# EAGLE design uradmonitor_D (EAGLE 6.1)
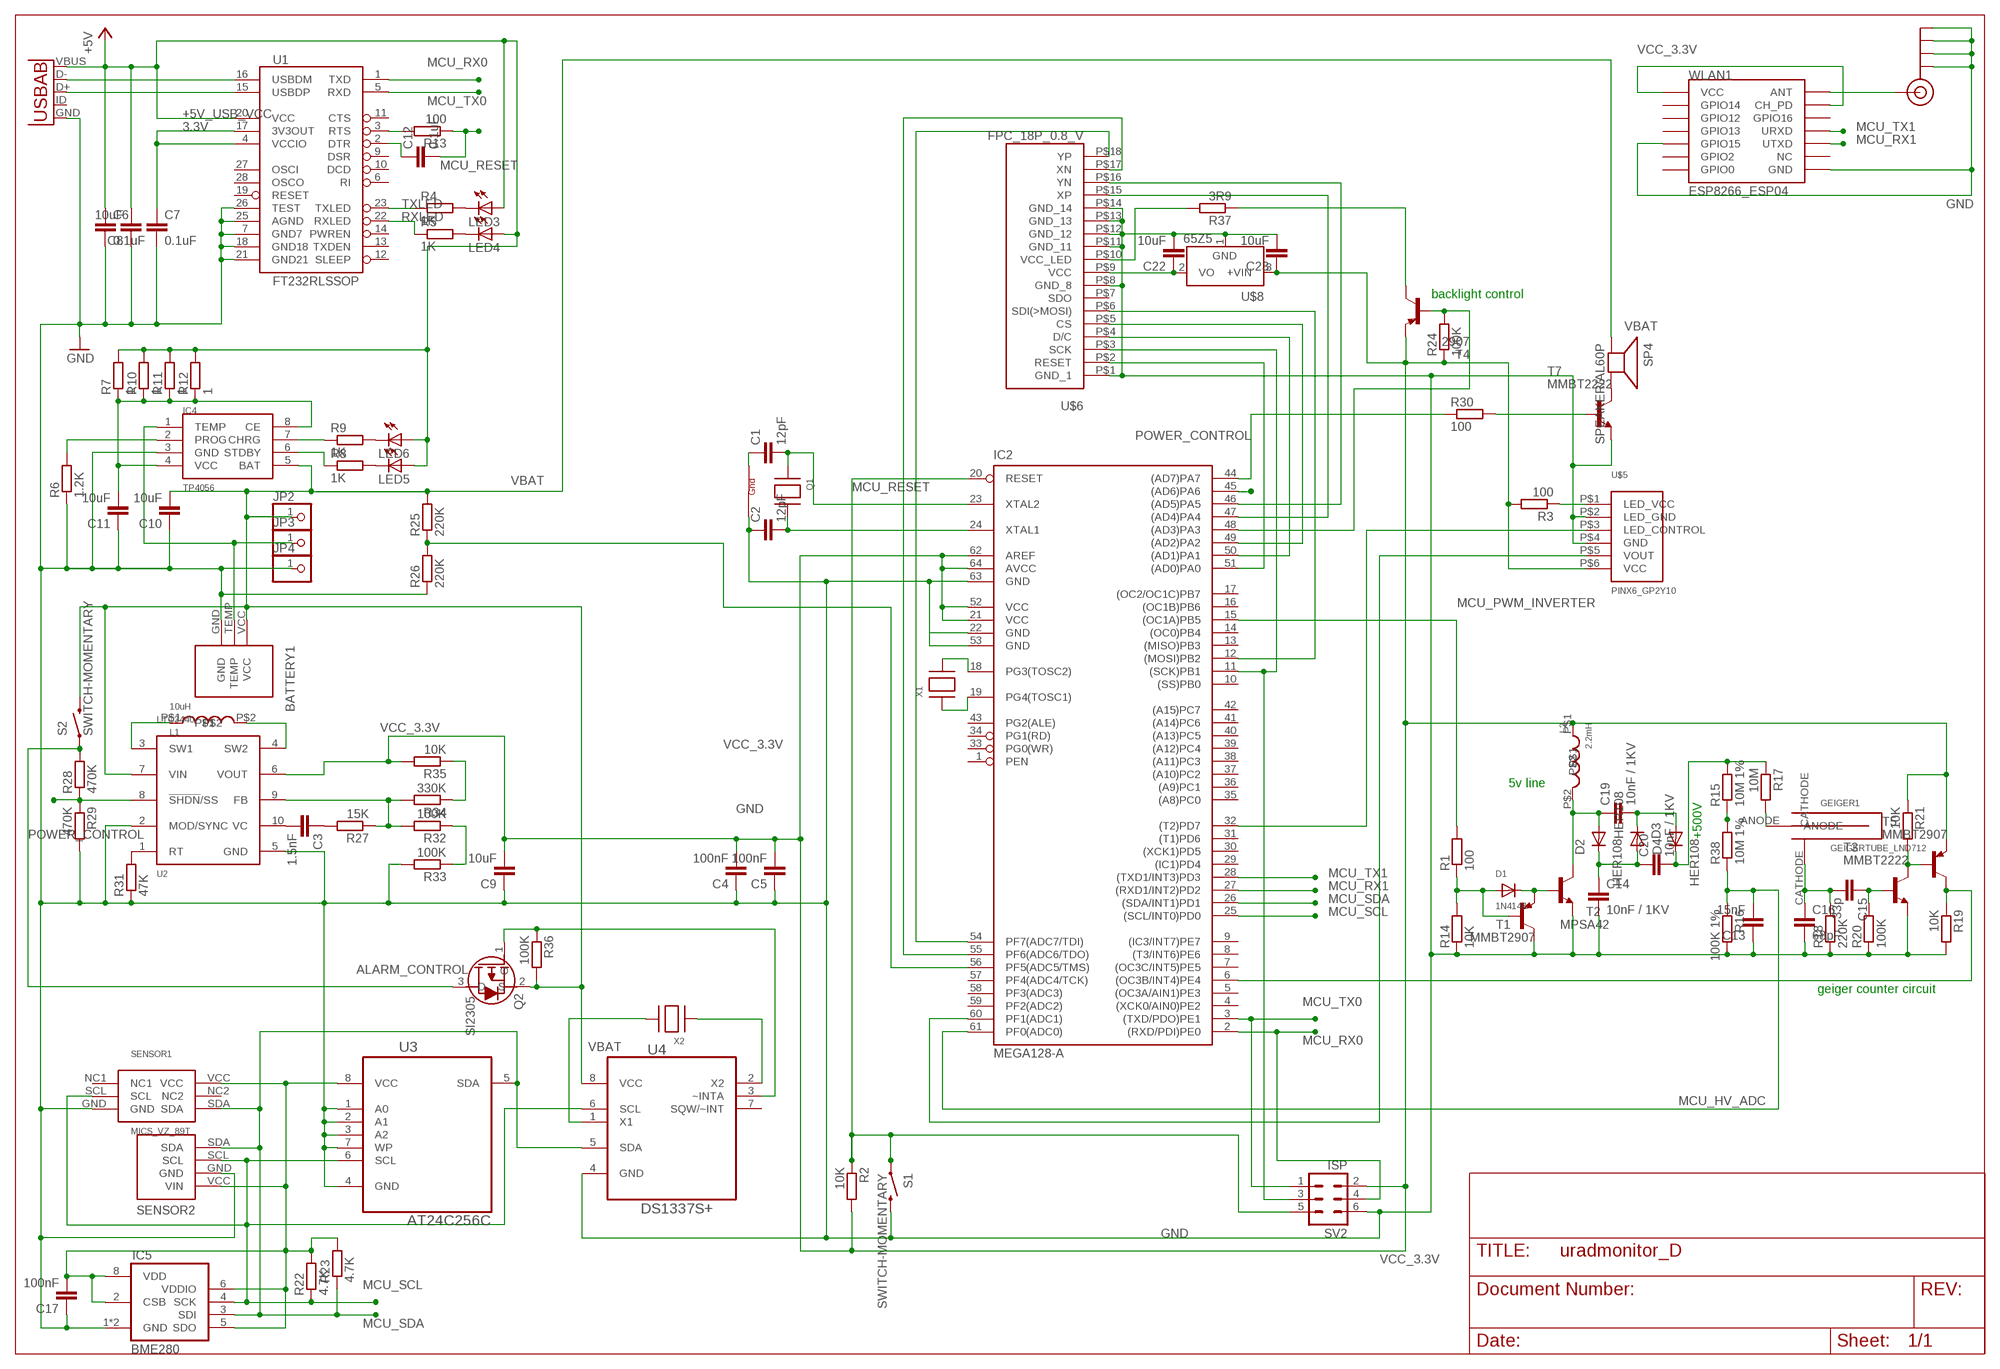
[diagram p0: schematic, sheet 1]

## Parts
BATTERY1  BAT-CASIO-NP40BATTERY  [BAT-CASIO-NP40]
C1  12pF  C-EUC0805K  [C0805K]
C2  12pF  C-EUC0805K  [C0805K]
C3  1.5nF  C-EUC0805K  [C0805K]
C4  100nF  C-EUC0805K  [C0805K]
C5  100nF  C-EUC0805K  [C0805K]
C6  0.1uF  CAP0805  [0805]
C7  0.1uF  CAP0805  [0805]
C8  10uF  C-EUC0805K  [C0805K]
C9  10uF  C-EUC0805K  [C0805K]
C10  10uF  C-EUC0805K  [C0805K]
C11  10uF  C-EUC0805K  [C0805K]
C12  0.1uF  CAP0805  [0805]
C13  15nF  C-EUC0805K  [C0805K]
C14  10nF / 1KV  C-EUC1206K  [C1206K]
C15  33p  C-EUC0805K  [C0805K]
C16  68pF  C-EUC0805K  [C0805K]
C17  100nF  C-EUC0805K  [C0805K]
C19  10nF / 1KV  C-EUC1206K  [C1206K]
C20  10nF / 1KV  C-EUC1206K  [C1206K]
C22  10uF  C-EUC0805  [C0805]
C23  10uF  C-EUC0805  [C0805]
D1  1N4148  DIODESOD-323F  [SOD-323F]
D2  HER108  DIODE-DO-214AC  [DO-214AC]
D3  HER108  DIODE-DO-214AC  [DO-214AC]
D4  HER108  DIODE-DO-214AC  [DO-214AC]
GEIGER1  GEIGERTUBE_LND712  [GEIGERTUBE_LND712]
IC2  MEGA128-A  [TQFP64]
IC4  TP4056  [TP4056]
IC5  BME280  [BME280]
J$1  SMA_EDGE  [SMA-EDGE]
JP2  PINHD-1X1CB  [1X01-CLEANBIG]
JP3  PINHD-1X1CB  [1X01-CLEANBIG]
JP4  PINHD-1X1CB  [1X01-CLEANBIG]
L1  10uH  INDUCTOR  [DO1608]
L2  2.2mH  INDUCTOR  [DO1608]
LED3  LEDCHIP-LED0805  [CHIP-LED0805]
LED4  LEDCHIP-LED0805  [CHIP-LED0805]
LED5  LED3MM  [LED3MM]
LED6  LED3MM  [LED3MM]
Q1  XTAL-4-3225  [NX3225]
Q2  SI2305  [SOT23]
R1  100  R-EU_R0805  [R0805]
R2  10K  R-EU_R0805  [R0805]
R3  100  R-EU_R0805  [R0805]
R4  1K  R-EU_R0805  [R0805]
R5  1K  R-EU_R0805  [R0805]
R6  1.2K  R-EU_R0805  [R0805]
R7  1  R-EU_R0805  [R0805]
R8  1K  R-EU_R0805  [R0805]
R9  1K  R-EU_R0805  [R0805]
R10  1  R-EU_R0805  [R0805]
R11  1  R-EU_R0805  [R0805]
R12  1  R-EU_R0805  [R0805]
R13  100  R-EU_R0805  [R0805]
R14  10K  R-EU_R0805  [R0805]
R15  10M 1%  R-EU_0204/7  [0204/7]
R16  100K 1%  R-EU_R0805  [R0805]
R17  10M  R-EU_0204/7  [0204/7]
R18  220K  R-EU_0204/7  [0204/7]
R19  10K  R-EU_R0805  [R0805]
R20  100K  R-EU_R0805  [R0805]
R21  10K  R-EU_R0805  [R0805]
R22  4.7K  R-EU_R0805  [R0805]
R23  4.7K  R-EU_R0805  [R0805]
R24  100K  R-EU_R0805  [R0805]
R25  220K  R-EU_R0805  [R0805]
R26  220K  R-EU_R0805  [R0805]
R27  15K  R-EU_R0805  [R0805]
R28  470K  R-EU_R0805  [R0805]
R29  470K  R-EU_R0805  [R0805]
R30  100  R-EU_R0805  [R0805]
R31  47K  R-EU_R0805  [R0805]
R32  100K  R-EU_R0805  [R0805]
R33  100K  R-EU_R0805  [R0805]
R34  330K  R-EU_R0805  [R0805]
R35  10K  R-EU_R0805  [R0805]
R36  100K  R-EU_R0805  [R0805]
R37  3R9  R-EU_R0805  [R0805]
R38  10M 1%  R-EU_0204/7  [0204/7]
S1  SWITCH-MOMENTARY  SWITCH-MOMENTARY-2-SMD-1101NE  [TACTILE-SWITCH-1101NE]
S2  SWITCH-MOMENTARY  SWITCH-MOMENTARY-2SIDE_EZ  [TACTILE-PTH-SIDEEZ]
SENSOR1  MICS_VZ_89T  [MICS_VZ_89T]
SENSOR2  BMP180  SENSOR_GY68GY-86DIP  [SENSOR_GY68]
SP4  SPEAKER/AL60P  [AL60P]
SV2  ISP  MA03-2  [MA03-2]
T1  MMBT2907  MMBT2907ALT1-PNP-SOT23-BEC  [SOT23-BEC]
T2  MPSA42  MMBTA42LT1-NPN-SOT23-BEC  [SOT23-BEC]
T3  MMBT2222  MMBT2222ALT1-NPN-SOT23-BEC  [SOT23-BEC]
T4  2907  MMBT2907ALT1-PNP-SOT23-BEC  [SOT23-BEC]
T5  MMBT2907  MMBT2907ALT1-PNP-SOT23-BEC  [SOT23-BEC]
T7  MMBT2222  MMBT2222ALT1-NPN-SOT23-BEC  [SOT23-BEC]
U1  FT232RLSSOP  [SSOP28DB]
U2  LTC3440  [MSOP-10]
U3  AT24C256C  AT24C512BN-SH25-B  [SOIC127P600X175-8N]
U4  DS1337S+  [SOIC127P600X175-8N]
U$2  USB_AB  [USB-AB-MICRO-SMD]
U$5  PINX6_GP2Y10  [PINX6_GP2Y10]
U$6  FPC_18P_0.8_V  [FPC_18P_0.8_V]
U$8  65Z5  [SOT23]
WLAN1  ESP8266_ESP04  [ESP8266_ESP04]
X1  XTAL-3.2X1.5  [XTAL3215]
X2  XTAL-3.2X1.5  [XTAL3215]

## Nets
3.3V [power]: C7.1 U1.4(VCCIO) U1.17(3V3OUT)
+5V_USB_VCC: C6.1 C8.2 LED3.A LED4.A LED5.A LED6.A R7.2 R10.2 R11.2 R12.2 U1.20(VCC) U$2.VBUS ; supply symbol labelled +5V
ALARM_CONTROL: Q2.3(D) R28.2 S2.1
GND: BATTERY1.GND C2.1 C4.1 C5.1 C6.2 C7.2 C8.1 C9.1 C10.1 C11.1 C13.1 C14.2 C16.2 C17.1 C22.2 C23.2 IC2.22(GND) IC2.53(GND) IC2.63(GND) IC4.3(GND) IC5.1(GND) IC5.7(GND) J$1.GND@0(GND) J$1.GND@1(GND) J$1.GND@2(GND) J$1.GND@3(GND) JP4.1 Q1.2(G2) R6.1 R14.1 R16.2 R18.1 R19.2 R20.1 R26.1 R29.2 R31.1 R33.2 S1.P$2 SENSOR1.GND SENSOR2.GND SV2.6 T1.C T2.E T3.E T7.E U1.7(GND7) U1.18(GND18) U1.21(GND21) U1.25(AGND) U1.26(TEST) U2.2(MOD/SYNC) U2.5(GND) U3.1(A0) U3.2(A1) U3.3(A2) U3.4(GND) U3.7(WP) U4.4(GND) U$2.GND U$5.P$2(LED_GND) U$5.P$4(GND) U$6.P$1(GND_1) U$6.P$8(GND_8) U$6.P$11(GND_11) U$6.P$12(GND_12) U$6.P$13(GND_13) U$6.P$14(GND_14) U$8.1(GND) WLAN1.GND WLAN1.GPIO15
MCU_HV_ADC: C13.2 IC2.61(PF0(ADC0)) R16.1 R38.1
MCU_INT4: IC2.6((OC3B/INT4)PE4) R19.1 T5.C
MCU_PWM_INVERTER: IC2.15((OC1A)PB5) R1.2
MCU_RESET: C12.2 IC2.20(RESET) R2.1 R13.1 S1.P$1 SV2.5
MCU_RX0: IC2.2((RXD/PDI)PE0) SV2.4 U1.1(TXD)
MCU_RX1: IC2.27((RXD1/INT2)PD2) WLAN1.UTXD
MCU_SCL: IC2.25((SCL/INT0)PD0) IC5.4(SCK) R22.1 SENSOR1.SCL SENSOR2.SCL U3.6(SCL) U4.6(SCL)
MCU_SDA: IC2.26((SDA/INT1)PD1) IC5.3(SDI) R23.1 SENSOR1.SDA SENSOR2.SDA U3.5(SDA) U4.5(SDA)
MCU_TX0: IC2.3((TXD/PDO)PE1) SV2.1 U1.5(RXD)
MCU_TX1: IC2.28((TXD1/INT3)PD3) WLAN1.URXD
N$1: J$1.SIG(SIGNAL) WLAN1.ANT
N$2: LED3.C R4.2
N$3: IC2.56(PF5(ADC5/TMS)) R25.1 R26.2
N$4: L1.P$2 U2.4(SW2)
N$5: R3.1 U$5.P$1(LED_VCC)
N$6: IC2.11((SCK)PB1) SV2.3 U$6.P$3(SCK)
N$7: LED4.C R5.2
N$8: D1.A R1.1 R14.2 T1.B
N$9: C1.2 IC2.23(XTAL2) Q1.1(X1)
N$10: L1.P$1 U2.3(SW1)
N$11: C2.2 IC2.24(XTAL1) Q1.3(X2)
N$12: IC2.18(PG3(TOSC2)) X1.P$2
N$13: R37.1 T4.C
N$14: IC2.12((MOSI)PB2) U$6.P$6(SDI(>MOSI))
N$15: U1.16(USBDM) U$2.D-
N$16: U1.15(USBDP) U$2.D+
N$17: D1.C T1.E T2.B
N$18: IC4.6(STDBY) R8.1
N$19: GEIGER1.ANODE R17.2
N$20: C15.1 R20.2 T3.B
N$21: IC4.7(CHRG) R9.1
N$22: LED6.K(C) R9.2
N$23: IC2.32((T2)PD7) U$5.P$3(LED_CONTROL)
N$24: LED5.K(C) R8.2
N$26: C12.1 U1.2(DTR)
N$27: IC4.2(PROG) R6.2
N$28: R13.2 U1.3(RTS)
N$29: C11.2 IC4.4(VCC) IC4.8(CE) R7.1 R10.1 R11.1 R12.1
N$30: IC2.19(PG4(TOSC1)) X1.P$1
N$31: BATTERY1.TEMP IC4.1(TEMP) JP3.1
N$32: IC2.60(PF1(ADC1)) U$5.P$5(VOUT)
N$33: IC2.44((AD7)PA7) R30.1
N$34: R31.2 U2.1(RT)
N$35: C14.1 C20.1 D2.C D3.A
N$36: IC2.51((AD0)PA0) U$6.P$2(RESET)
N$37: C3.2 U2.10(VC)
N$38: IC2.50((AD1)PA1) U$6.P$4(D/C)
N$39: IC2.49((AD2)PA2) U$6.P$5(CS)
N$40: IC2.47((AD4)PA4) U$6.P$15(XP)
N$41: IC2.46((AD5)PA5) U$6.P$16(YN)
N$42: C15.2 C16.1 GEIGER1.CATHODE R18.2
N$43: IC2.54(PF7(ADC7/TDI)) U$6.P$18(YP)
N$44: IC2.55(PF6(ADC6/TDO)) U$6.P$17(XN)
N$45: IC2.48((AD3)PA3) R24.2 T4.B
N$46: C3.1 R27.2
N$47: R27.1 R32.2 R34.2 U2.9(FB)
N$49: R32.1 R33.1
N$50: R34.1 R35.1
N$51: C19.1 D2.A L2.P$2 T2.C
N$52: C22.1 U$6.P$9(VCC) U$8.2(VO)
N$53: C19.2 D3.C D4.A
N$54: C20.2 D4.C R15.2 R17.1
N$55: U4.2(X2) X2.P$1
N$56: U4.1(X1) X2.P$2
N$57: R30.2 T7.B
N$59: R21.2 T3.C T5.B
N$61: R15.1 R38.2
N$65: Q2.1(G) R36.1 U4.3(~INTA)
N$69: C1.1 Q1.4(G1)
N$75: R37.2 U$6.P$10(VCC_LED)
POWER_CONTROL: IC2.45((AD6)PA6) R28.1 R29.1 U2.8(!SHDN!/SS)
RXLED: R5.1 U1.22(RXLED)
SOLDER_TUBE: SP4.2(-) T7.C
TXLED: R4.1 U1.23(TXLED)
VBAT: BATTERY1.VCC C10.2 IC4.5(BAT) JP2.1 Q2.2(S) R25.2 R36.2 S2.2 SP4.1(+) U2.7(VIN) U4.8(VCC)
VCC_3.3V: C4.2 C5.2 C9.2 C17.2 C23.1 IC2.21(VCC) IC2.52(VCC) IC2.62(AREF) IC2.64(AVCC) IC5.2(CSB) IC5.5(SDO) IC5.6(VDDIO) IC5.8(VDD) L2.P$1 R2.2 R3.2 R21.1 R22.2 R23.2 R24.1 R35.2 SENSOR1.VCC SENSOR2.VCC(VIN) SV2.2 T4.E T5.E U2.6(VOUT) U3.8(VCC) U$5.P$6(VCC) U$8.3(+VIN) WLAN1.CH_PD WLAN1.VCC
Unconnected: IC2.1(PEN) IC2.4((XCK0/AIN0)PE2) IC2.5((OC3A/AIN1)PE3) IC2.7((OC3C/INT5)PE5) IC2.8((T3/INT6)PE6) IC2.9((IC3/INT7)PE7) IC2.10((SS)PB0) IC2.13((MISO)PB3) IC2.14((OC0)PB4) IC2.16((OC1B)PB6) IC2.17((OC2/OC1C)PB7) IC2.29((IC1)PD4) IC2.30((XCK1)PD5) IC2.31((T1)PD6) IC2.33(PG0(WR)) IC2.34(PG1(RD)) IC2.35((A8)PC0) IC2.36((A9)PC1) IC2.37((A10)PC2) IC2.38((A11)PC3) IC2.39((A12)PC4) IC2.40((A13)PC5) IC2.41((A14)PC6) IC2.42((A15)PC7) IC2.43(PG2(ALE)) IC2.57(PF4(ADC4/TCK)) IC2.58(PF3(ADC3)) IC2.59(PF2(ADC2)) SENSOR1.NC1 SENSOR1.NC2 U1.6(RI) U1.9(DSR) U1.10(DCD) U1.11(CTS) U1.12(SLEEP) U1.13(TXDEN) U1.14(PWREN) U1.19(RESET) U1.27(OSCI) U1.28(OSCO) U4.7(SQW/~INT) U$2.ID(USBID) U$6.P$7(SDO) WLAN1.GPIO0 WLAN1.GPIO2 WLAN1.GPIO12 WLAN1.GPIO13 WLAN1.GPIO14 WLAN1.GPIO16 WLAN1.NC

## Notes on the sheet
- backlight control
- 5v line
- +500V
- geiger counter circuit

## Library data of the parts
BATTERY1 = uradmonitor:BAT-CASIO-NP40: Li-ion 3.7V 1500mAh battery , compatible with Casio-NP-40
C1-C5 C8-C11 C13-C17 C19 C20 = rcl:C-EU: CAPACITOR, European symbol
C6 C7 C12 = SparkFun:CAP: Capacitor Standard 0603 ceramic capacitor, and 0.1" leaded capacitor.
C22 C23 = resistor:C-EU: CAPACITOR, European symbol
D1 = adafruit:DIODE: Diode SMADIODE - SMA Surface Mount Package 20V 1A Schottky Diode Digikey: 641-1014-6-ND DO-1N4148 - Through Hole Small Current Diode SOD-123 20V 1 A (.5mV Vf) Schottky Diode - Digikey: MBRX120TPMSCT-ND SOD-323 10V 570mA (.38mV Vf, 3ns) Schottky Diode - Digikey: ZLLS410CT-ND SOD-523 30V 30mA Schottky Diode (RB751S-40TE61) - Digikey: RB751S-40TE61CT-ND SOT23-R/W - SOT23 Package (R = Solder Paste/Reflow Ovens, W = Hand-Soldering) BAT54Film 40V 300mA - Digikey: 497-7162-1-ND
D2-D4 = diode:DIODE-: DIODE
GEIGER1 = uradmonitor:GEIGERTUBE_LND712
IC2 = atmel:MEGA128: MICROCONTROLLER 128 Kbytes FLASH 4 Kbytes SRAM 4 Kbytes EEPROM DUAL USART 8-channel 10 bit ADC Source: avr.lbr; MPN: ATMEGA128-16AU; OC_FARNELL: 9171118; OC_NEWARK: 95K7364
IC4 = uradmonitor:TP4056
IC5 = uradmonitor:BME280: DIGITAL HUMIDITY, PRESSURE AND TEMPERATURE SENSOR * Digital interface IÂ²C (up to 3.4 MHz) and SPI (3 and 4 wire, up to 10 MHz)* Supply voltage VDD main supply voltage range: 1.71 V to 3.6 V*VDDIO interface voltage range: 1.2 V to 3.6 V Operating range -40â€¦+85 Â°C, 0â€¦100 % rel. humidity, 300â€¦1100 hPa
J$1 = sparkfun-connectors:SMA_EDGE: SMA Antenna Connector End launch SMA connector. The paste layer has been removed so that the connector can be hand soldered onto the board after reflow.
JP2-JP4 = adafruit:PINHD-1X1: Pin header 1x1 for 0.1" spacing With round pins
L1 L2 = uradmonitor:INDUCTOR
LED3-LED6 = adafruit:LED: LED OSRAM: - CHIPLED LG R971, LG N971, LY N971, LG Q971, LY Q971, LO R971, LY R971 LH N974, LH R974 LS Q976, LO Q976, LY Q976 LO Q996 - Hyper CHIPLED LW Q18S LB Q993, LB Q99A, LB R99A - SideLED LS A670, LO A670, LY A670, LG A670, LP A670 LB A673, LV A673, LT A673, LW A673 LH A674 LY A675 LS A676, LA A676, LO A676, LY A676, LW A676 LS A679, LY A679, LG A679 - Hyper Micro SIDELED® LS Y876, LA Y876, LO Y876, LY Y876 LT Y87S - SmartLED LW L88C, LW L88S LB L89C, LB L89S, LG L890 LS L89K, LO L89K, LY L89K LS L896, LA L896, LO L896, LY L896 - TOPLED LS T670, LO T670, LY T670, LG T670, LP T670 LSG T670, LSP T670, LSY T670, LOP T670, LYG T670 LG T671, LOG T671, LSG T671 LB T673, LV T673, LT T673, LW T673 LH T674 LS T676, LA T676, LO T676, LY T676, LB T676, LH T676, LSB T676, LW T676 LB T67C, LV T67C, LT T67C, LS T67K, LO T67K, LY T67K, LW E67C LS E67B, LA E67B, LO E67B, LY E67B, LB E67C, LV E67C, LT E67C LW T67C LS T679, LY T679, LG T679 LS T770, LO T770, LY T770, LG T770, LP T770 LB T773, LV T773, LT T773, LW T773 LH T774 LS E675, LA E675, LY E675, LS T675 LS T776, LA T776, LO T776, LY T776, LB T776 LHGB T686 LT T68C, LB T68C - Hyper Mini TOPLED® LB M676 - Mini TOPLED Santana® LG M470 LS M47K, LO M47K, LY M47K Source: http://www.osram.convergy.de/
Q1 = adafruit:XTAL-4: Classic 4-pin 3.2 x 2.5mm crystal
Q2 = uradmonitor:SI2305: P-Channel 8 V (D-S) MOSFET
R1 R3 R14 R24 R37 = resistor:R-EU_: RESISTOR, European symbol
R2 R4-R13 R15-R23 R25-R36 R38 = rcl:R-EU_: RESISTOR, European symbol
S1 S2 = sparkfun-electromechanical:SWITCH-MOMENTARY-2: Various NO switches- pushbuttons, reed, etc
SENSOR1 = uradmonitor:MICS_VZ_89T: The MiCS-VZ-86/89 combines state-of-the-art MOS sensor technology with intelligent detection algorithms to monitor VOCs and CO2 equivalent variations in confined spaces
SENSOR2 = uradmonitor:SENSOR_GY68: GY-68 breadboard featuring 3.3V regulator and BMP180 sensor for 5V input.
SP4 = adafruit:SPEAKER: SPEAKER Source: Buerklin Added PS12 (for part # PS1240 piezo) http://www.ladyada.net/library/pcb/eaglelibrary.html
SV2 = con-lstb:MA03-2: PIN HEADER; OC_FARNELL: unknown; OC_NEWARK: unknown
T1 T4 T5 = transistor-neu-to92:*-PNP-: PNP Transistror
T2 T3 = transistor-neu-to92:*-NPN-: NPN Transistror BF959 corrected 2008.03.06
T7 = transistor:*-NPN-: NPN Transistror BF959 corrected 2008.03.06
U1 = SparkFun:FT232RL: USB UART FT232RL 4th Generation USB UART (USB <-> Serial) Controller. Spark Fun Electronics SKU : COM-00650
U2 = uradmonitor:LTC3440: buck-boost converter from Linear Technologies
U3 = Atmel_By_element14_Batch_1-00:AT24C512BN-SH25-B: Two-wire Serial EEPROM; MPN: AT24C512BN-SH25-B; OC_FARNELL: 1362656; OC_NEWARK: 50M3328; PACKAGE: SOIC-8; SUPPLIER: Atmel
U4 = Maxim_By_element14_Batch_1:DS1337S+: 64 x 8, Serial, I2C Real-Time Clock; MPN: DS1337S+; OC_FARNELL: 1379748; OC_NEWARK: 08J6237; PACKAGE: SOIC-8; SUPPLIER: Maxim
U$2 = sparkfun-connectors:USB_AB: This is a USB AB connector that is compatible with USB OTG. i.e. this connector can serve as a host or device
U$5 = uradmonitor:PINX6_GP2Y10
U$6 = uradmonitor:FPC_18P_0.8_V
U$8 = uradmonitor:65Z5: 3V regulator XC6206P302MR 65Z5 http://datasheet.octopart.com/XC6206P302MR-Torex-datasheet-514348.pdf
WLAN1 = uradmonitor:ESP8266_ESP04
X1 X2 = adafruit:XTAL: Low cost SMT crystals, no capacitors included http://www.ladyada.net/library/eagle

## Net classes
1 power: width 0.254 mm

## Board
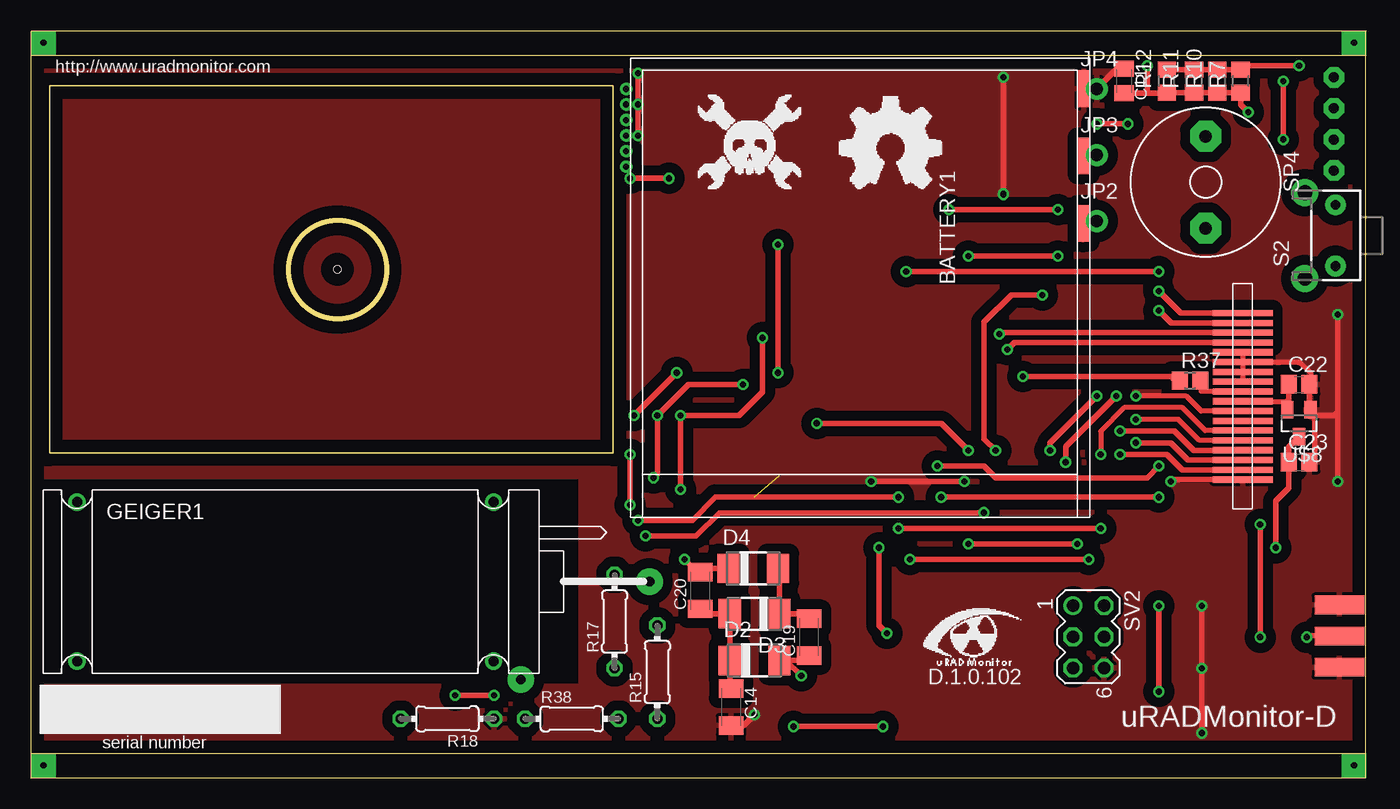
[diagram p1: board, top side]
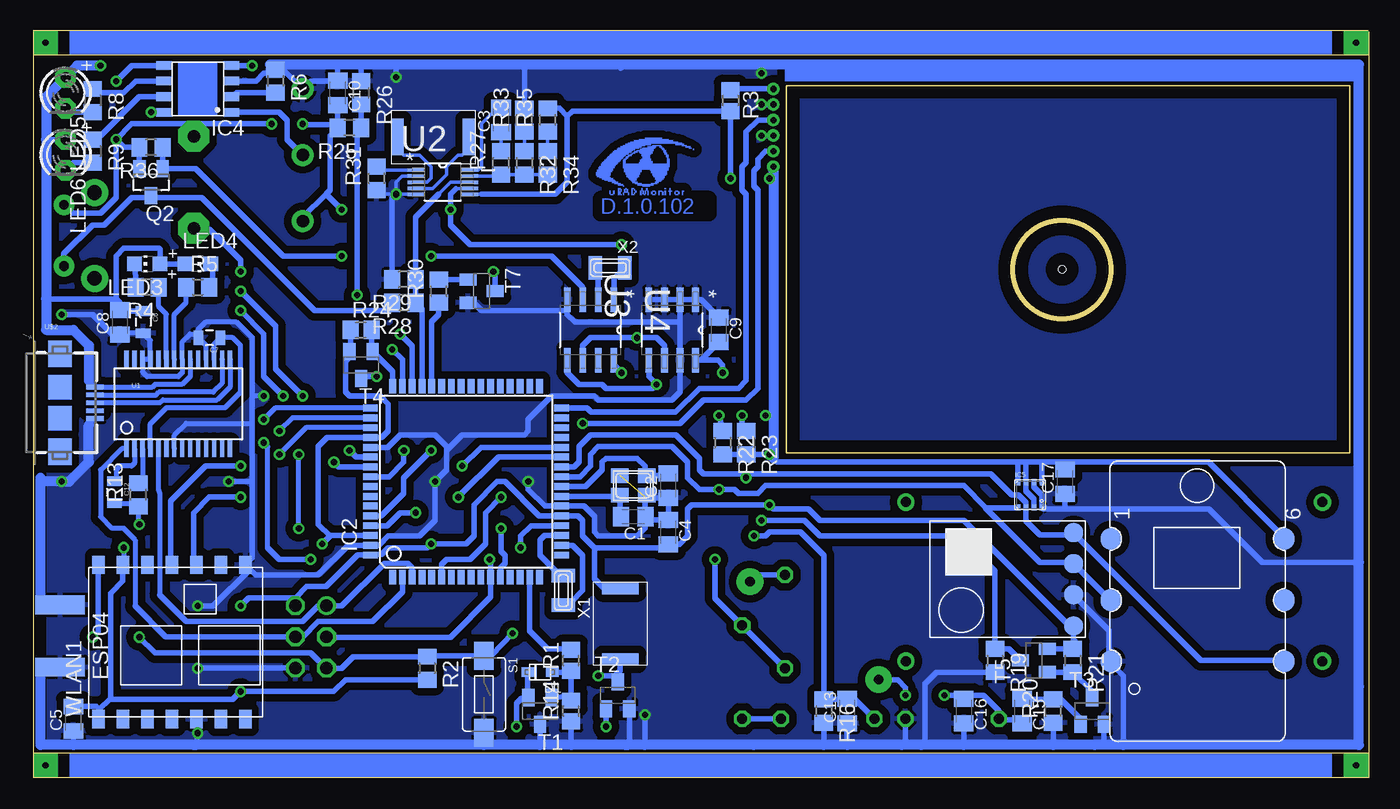
[diagram p2: board, bottom side, seen from below]

Size 109.03 x 61.03 mm. Coordinates in mm from the lower left corner, seen from the top.
Outline: 0,60.95 0,2
Outline: 0,2 0,0 109,0 109,2
Outline: 0,2 109,2
Outline: 0.03,61.03 109.03,61.03
Outline: 0.03,59.03 109.03,59.03
Outline: 109,2 109,60.95
Outline: 1.53,56.53 47.53,56.53 47.53,26.53 1.53,26.53 1.53,56.53
Outline: circle at 25.03,41.53 radius 4
Copper layers (1*16): Top 0.035mm / dielectric 1.5mm / Bottom 0.035mm
Design rules: minimum track width 10mil, minimum drill 24mil, track to track 8mil, track to pad 8mil, pad to pad 8mil, via to via 8mil, smd to smd 8mil, copper to edge 40mil, drill to drill 8mil, minimum pad ring 10mil, minimum via ring 8mil, stop-mask expansion 4mil, vias tented up to drill 0mil, thermal gap 10mil
Holes 0.6 mm at 25.03,41.53
Milling: area 1.5,26.5 to 47.5,56.5

### Footprints (pad centres in the part's own frame; a part is rotated, then mirrored left to right if it is on the bottom)
BAT-CASIO-NP40 = smd 3 x 1: GND 34.59,-36.85; TEMP 29.09,-36.85; VCC 23.59,-36.85
C0805K = smd 1.3 x 1.6: 1 -1,0; 2 1,0
0805 = smd 0.8 x 1.2: 1 -0.9,0; 2 0.9,0
C1206K = smd 1.5 x 2: 1 -1.5,0; 2 1.5,0
C0805 = smd 1.3 x 1.5: 1 -0.85,0; 2 0.85,0
SOD-323F = smd 1 x 0.8: A -1,0; C 1,0
DO-214AC = smd 1.8 x 2.4: A 2.025,0; C -2.025,0
GEIGERTUBE_LND712 = drill 0.8 pad 2.184: ANODE 49.61,-7.57; CATHODE 39.11,-15.58
TQFP64 = smd 1.194 x 0.559: 1 -7.8,6; 2 -7.8,5.2; 3 -7.8,4.4; 4 -7.8,3.6; 5 -7.8,2.8; 6 -7.8,2; 7 -7.8,1.2; 8 -7.8,0.4; 9 -7.8,-0.4; 10 -7.8,-1.2; 11 -7.8,-2; 12 -7.8,-2.8; 13 -7.8,-3.6; 14 -7.8,-4.4; 15 -7.8,-5.2; 16 -7.8,-6; 33 7.8,-6; 34 7.8,-5.2; 35 7.8,-4.4; 36 7.8,-3.6; 37 7.8,-2.8; 38 7.8,-2; 39 7.8,-1.2; 40 7.8,-0.4; 41 7.8,0.4; 42 7.8,1.2; 43 7.8,2; 44 7.8,2.8; 45 7.8,3.6; 46 7.8,4.4; 47 7.8,5.2; 48 7.8,6 | smd 0.559 x 1.194: 17 -6,-7.8; 18 -5.2,-7.8; 19 -4.4,-7.8; 20 -3.6,-7.8; 21 -2.8,-7.8; 22 -2,-7.8; 23 -1.2,-7.8; 24 -0.4,-7.8; 25 0.4,-7.8; 26 1.2,-7.8; 27 2,-7.8; 28 2.8,-7.8; 29 3.6,-7.8; 30 4.4,-7.8; 31 5.2,-7.8; 32 6,-7.8; 49 6,7.8; 50 5.2,7.8; 51 4.4,7.8; 52 3.6,7.8; 53 2.8,7.8; 54 2,7.8; 55 1.2,7.8; 56 0.4,7.8; 57 -0.4,7.8; 58 -1.2,7.8; 59 -2,7.8; 60 -2.8,7.8; 61 -3.6,7.8; 62 -4.4,7.8; 63 -5.2,7.8; 64 -6,7.8
TP4056 = smd 1.3 x 0.7: 1 -2.75,1.905; 2 -2.75,0.635; 3 -2.75,-0.635; 4 -2.75,-1.905; 5 2.75,-1.905; 6 2.75,-0.635; 7 2.75,0.635; 8 2.75,1.905
BME280 = smd 0.35 x 0.5: 1 0.975,-1.025; 2 0.325,-1.025; 3 -0.325,-1.025; 4 -0.975,-1.025; 5 -0.975,1.025; 6 -0.325,1.025; 7 0.325,1.025; 8 0.975,1.025
SMA-EDGE = smd 1.524 x 4.064: GND@0 0,0; GND@1 5.08,0; SIG 2.54,0 | smd 1.524 x 4.064 bottom: GND@2 0,0; GND@3 5.08,0
1X01-CLEANBIG = drill 1.016 pad 1.778: 1 0,0
DO1608 = smd 1 x 3: P$1 -3.04,-0.43; P$2 2.76,-0.43
CHIP-LED0805 = smd 1.2 x 1.2: A 0,-1.05; C 0,1.05
LED3MM = drill 0.813 pad 1.676 octagon: A -1.27,0; K 1.27,0
NX3225 = smd 1.4 x 1.2: 1 -1.1,-0.8; 2 1.1,-0.8; 3 1.1,0.8; 4 -1.1,0.8
SOT23 = smd 1 x 1.4: 1 -0.95,-1.1; 2 0.95,-1.1; 3 0,1.1
R0805 = smd 1.3 x 1.5: 1 -0.85,0; 2 0.85,0
R0805' = smd 1.3 x 1.5: 1 -0.95,0; 2 0.95,0
0204/7 = drill 0.813 octagon: 1 -3.81,0; 2 3.81,0
TACTILE-SWITCH-1101NE = smd 2.3 x 1.6: P$1 -3.15,0; P$2 3.15,0
TACTILE-PTH-SIDEEZ = drill 0.8 pad 1.7: 1 -2.5,0; 2 2.5,0 | drill 1.2 pad 2.2: ANCHOR1 -3.5,2.5; ANCHOR2 3.5,2.5
MICS_VZ_89T = smd 1.778 x 1.778: GND 16.349,-14.182; NC1 6.35,-14.183; NC2 11.356,-0.1; SCL 11.349,-14.183; SDA 16.351,-0.113; VCC 6.345,-0.105
SENSOR_GY68 = smd 1.524 x 1.524: GND 0.953,-3.493; SCL 0.953,-6.032; SDA 0.953,-8.572; VCC 0.953,-0.953
AL60P = drill 1.016 pad 2.54 octagon: 1 -3.759,0; 2 3.759,0
MA03-2 = drill 1.016: 1 -2.54,-1.27 | drill 1.016 octagon: 2 -2.54,1.27; 3 0,-1.27; 4 0,1.27; 5 2.54,-1.27; 6 2.54,1.27
SOT23-BEC = smd 1 x 1.4: B -0.95,-1.1; C 0,1.1; E 0.95,-1.1
SSOP28DB = smd 0.348 x 1.397: 1 -4.225,-3.656; 2 -3.575,-3.656; 3 -2.925,-3.656; 4 -2.275,-3.656; 5 -1.625,-3.656; 6 -0.975,-3.656; 7 -0.325,-3.656; 8 0.325,-3.656; 9 0.975,-3.656; 10 1.625,-3.656; 11 2.275,-3.656; 12 2.925,-3.656; 13 3.575,-3.656; 14 4.225,-3.656; 15 4.225,3.656; 16 3.575,3.656; 17 2.925,3.656; 18 2.275,3.656; 19 1.625,3.656; 20 0.975,3.656; 21 0.325,3.656; 22 -0.325,3.656; 23 -0.975,3.656; 24 -1.625,3.656; 25 -2.275,3.656; 26 -2.925,3.656; 27 -3.575,3.656; 28 -4.225,3.656
MSOP-10 = smd 1.397 x 0.279: 1 -2.184,0.991; 2 -2.184,0.508; 3 -2.184,0; 4 -2.184,-0.508; 5 -2.184,-0.991; 6 2.184,-0.991; 7 2.184,-0.508; 8 2.184,0; 9 2.184,0.508; 10 2.184,0.991
SOIC127P600X175-8N = smd 1.981 x 0.559: 1 -2.464,1.905; 2 -2.464,0.635; 3 -2.464,-0.635; 4 -2.464,-1.905; 5 2.464,-1.905; 6 2.464,-0.635; 7 2.464,0.635; 8 2.464,1.905
SOIC127P600X175-8N' = smd 1.981 x 0.533: 1 -2.464,1.905; 2 -2.464,0.635; 3 -2.464,-0.635; 4 -2.464,-1.905; 5 2.464,-1.905; 6 2.464,-0.635; 7 2.464,0.635; 8 2.464,1.905
USB-AB-MICRO-SMD = smd 1.4 x 0.4: D+ 2.85,0; D- 2.85,0.65; GND 2.85,-1.3; ID 2.85,-0.65; VBUS 2.85,1.3 | smd 1.9 x 2: P$6 0,1.25; P$7 0,-1.25 | smd 1.9 x 2.2: P$8 0,4; P$9 0,-4
PINX6_GP2Y10 = drill 0.5 pad 0.813: P$1 0,3.81; P$2 0,2.54; P$3 0,1.27; P$4 0,0; P$5 0,-1.27; P$6 0,-2.54
FPC_18P_0.8_V = smd 0.5 x 4.9: P$1 -6.92,-0.66; P$2 -6.12,-0.66; P$3 -5.32,-0.66; P$4 -4.52,-0.66; P$5 -3.72,-0.66; P$6 -2.92,-0.66; P$7 -2.12,-0.66; P$8 -1.32,-0.66; P$9 -0.52,-0.66; P$10 0.28,-0.66; P$11 1.08,-0.66; P$12 1.88,-0.66; P$13 2.68,-0.66; P$14 3.48,-0.66; P$15 4.28,-0.66; P$16 5.08,-0.66; P$17 5.88,-0.66; P$18 6.68,-0.66
ESP8266_ESP04 = smd 1.5 x 1: ANT 7.4,4.8; CH_PD 7.4,2.8; GND 7.4,-7.2; GPIO0 -5.2,-7.2; GPIO2 -5.2,-5.2; GPIO12 -5.2,0.8; GPIO13 -5.2,-1.2; GPIO14 -5.2,2.8; GPIO15 -5.2,-3.2; GPIO16 7.4,0.8; NC 7.4,-5.2; URXD 7.4,-1.2; UTXD 7.4,-3.2; VCC -5.2,4.8
XTAL3215 = smd 1.1 x 1.9: P$1 1.2,0; P$2 -1.2,0

### Placement (x,y rotation side)
BATTERY1  49.11,21.7 90 top
C1  60.04,21.34 180 bottom
C2  57.18,23.88 90 bottom
C3  70.83,53.73 90 bottom
C4  57.18,20.07 270 bottom
C5  105.76,4.83 90 bottom
C6  100.04,37.22 270 bottom
C7  94.64,35.95 180 bottom
C8  101.95,37.22 90 bottom
C9  53.05,36.58 270 bottom
C10  84.17,55.95 270 bottom
C11  89.25,56.9 270 top
C12  102.39,23.34 270 bottom
C13  42.58,5.47 90 bottom
C14  57.18,5.79 270 top
C15  28.29,5.47 270 bottom
C16  33.05,5.47 270 bottom
C17  24.8,24.2 90 bottom
C19  63.53,11.5 90 top
C20  54.64,15.31 90 top
C22  103.53,32.14 0 top
C23  103.53,25.79 0 top
D1  67.66,8.64 180 bottom
D2  59.09,9.59 0 top
D3  59.09,13.41 180 top
D4  58.99,17.12 0 top
GEIGER1  0.89,23.61 0 top
IC2  73.69,24.2 90 bottom
IC4  95.6,56.27 180 bottom
IC5  27.64,23.13 0 bottom
J$1  106.84,9.05 90 top
JP2  87.03,45.47 0 top
JP3  87.03,50.87 0 top
JP4  87.03,56.27 0 top
L1  76.23,52.77 0 bottom
L2  60.67,12.45 270 bottom
LED3  99.72,41.98 90 bottom
LED4  95.6,41.98 270 bottom
LED5  106.39,55.95 270 bottom
LED6  106.39,50.87 270 bottom
Q1  60.04,23.88 0 bottom
Q2  99.41,48.65 180 bottom
R1  65.12,9.59 90 bottom
R2  10K  [R0805']  76.86,8.96 270 bottom
R3  52.1,55.31 270 bottom
R4  1K  [R0805']  99.72,40.08 180 bottom
R5  1K  [R0805']  95.6,40.08 0 bottom
R6  1.2K  [R0805']  89.25,56.9 270 bottom
R7  1  [R0805']  98.77,56.9 90 top
R8  1K  [R0805']  104.17,55.31 270 bottom
R9  1K  [R0805']  104.17,51.19 270 bottom
R10  1  [R0805']  96.87,56.9 90 top
R11  1  [R0805']  94.96,56.9 90 top
R12  1  [R0805']  92.74,56.9 90 top
R13  100  [R0805']  100.45,23.12 90 bottom
R14  65.12,5.47 90 bottom
R15  51.15,8.64 90 top
R16  100K 1%  [R0805']  44.48,5.47 270 bottom
R17  47.66,12.77 90 top
R18  34,4.83 180 top
R19  10K  [R0805']  30.51,9.59 270 bottom
R20  100K  [R0805']  25.75,5.47 90 bottom
R21  10K  [R0805']  24.16,9.59 270 bottom
R22  4.7K  [R0805']  52.73,27.38 270 bottom
R23  4.7K  [R0805']  50.83,27.38 270 bottom
R24  82.26,36.58 0 bottom
R25  220K  [R0805']  83.22,53.09 180 bottom
R26  220K  [R0805']  82.26,55.95 270 bottom
R27  15K  [R0805']  70.83,50.23 90 bottom
R28  470K  [R0805']  78.77,38.8 180 bottom
R29  470K  [R0805']  78.77,40.71 180 bottom
R30  100  [R0805']  75.91,39.76 90 bottom
R31  47K  [R0805']  80.99,48.97 90 bottom
R32  100K  [R0805']  68.93,50.23 270 bottom
R33  100K  [R0805']  68.93,53.73 90 bottom
R34  330K  [R0805']  67.02,50.23 270 bottom
R35  10K  [R0805']  67.02,53.73 90 bottom
R36  100K  [R0805']  99.41,51.51 180 bottom
R37  94.64,32.45 0 top
R38  44.16,4.83 0 top
S1  72.23,6.83 270 bottom
S2  106.52,44.29 90 top
SENSOR1  6.82,25.87 270 bottom
SENSOR2  23.14,11.47 180 bottom
SP4  95.92,48.65 270 top
SV2  86.35,11.52 270 top
T1  67.66,5.47 180 bottom
T2  61.31,6.74 0 bottom
T3  22.57,5.47 0 bottom
T4  82.26,33.73 180 bottom
T5  27.34,9.59 90 bottom
T7  72.42,39.76 270 bottom
U1  97.19,30.55 0 bottom
U2  75.59,48.65 0 bottom
U3  56.86,36.58 270 bottom
U4  DS1337S+  [SOIC127P600X175-8N']  63.53,36.58 270 bottom
U$2  106.84,30.64 0 bottom
U$5  48.61,52.46 0 top
U$6  98.28,31.28 90 top
U$8  103.53,28.96 180 top
WLAN1  98.9,10 90 bottom
X1  65.75,15.31 90 bottom
X2  61.94,41.66 180 bottom

### Tracks (layer width: path | path; a pad name or v marks a point on that pad's centre or on a via)
3.3V
  Bottom 0.406: U1.4 99.46,28.91 98.14,30.23 93.38,30.23 92.11,31.5 92.11,35.31 92.74,35.95 C7.1 94.26,35.43 U1.17
+5V_USB_VCC  (via drill 0.5 pad 0.25)
  Top 0.305: R11.2
  Top 0.457: R12.2 R11.2 | R11.2 R10.2 R7.2 99.09,58.17 v103.53,58.17
  Bottom 0.406: U$2.VBUS 104.01,31.94 | U$2.VBUS 99.29,31.94 99.09,32.14 96.87,32.14 96.21,32.8 U1.20 | 104.49,32.44 U$2.VBUS
  Bottom 0.457: LED4.A LED3.A 98.67,43.15 98.77,43.25 101.63,43.25 102.27,42.62 102.27,39.12 | LED6.A 107.98,52.14 | C6.1 101.85,38.12 C8.2 101.95,38.8 102.27,39.12 | 102.27,39.12 107.98,39.12
  Bottom 0.813: v103.53,58.17 105.44,58.17 LED5.A 107.98,55.63 107.98,52.14 107.98,39.12 107.98,36.58 105.76,36.58 104.49,35.31 104.49,32.44
ALARM_CONTROL
  Bottom 0.457: S2.1 106.52,42.8 104.17,45.16 103.22,45.16 101,47.38 99.58,47.38 Q2.3 99.24,47.38 95.28,47.38 86.07,38.17 80.36,38.17 R28.2
GND  (via drill 0.5 pad 0.25)
  Top 0.406: U$6.P$14 U$6.P$13 | U$6.P$13 U$6.P$12 U$6.P$11 | 104.39,30.16 U$8.1 104.48,29.92 104.81,29.6 | 104.81,26.21 C23.2 | 106.39,29.6 106.71,29.92 | U$6.P$13 103.62,33.96 104.49,33.09 104.49,32.24 C22.2 | U$6.P$8 95.55,29.96 94.33,31.19 v90.2,31.19
  Top 0.457: v106.71,24.2 106.71,29.92 v106.71,37.85 | v76.23,24.2 v68.61,24.2 | C14.2 58.22,4.29 v59.09,5.15 | C22.2 104.39,30.16 | 104.81,26.21 104.81,29.6 106.39,29.6 | v95.6,14.04 v95.6,8.96 v95.6,3.67 | BATTERY1.GND 87,56.29 JP4.1 88.66,57.9 C11.1 | U$6.P$1 93.22,24.36 v93.06,24.2 | v49.56,52.46 v49.56,55 v49.56,57.54 | v79.41,47.66 v79.41,57.22
  Bottom 0.305: U2.5 v79.41,47.66 | v79.41,47.66 80.63,47.66 R31.1 | v79.41,47.66 v79.41,47.7 79.41,48.65 78.9,49.16 U2.2 | R6.1 C11.1
  Bottom 0.406: 108.43,9.05 J$1.GND@0 | J$1.GND@1 108.43,14.13 | WLAN1.GND 91.92,17.62 | 91.6,17.51 WLAN1.GND | C5.1 105.76,2.7 | 108.43,24.7 108.43,24.52 108.43,24.33 108.3,24.2 | 104.49,28.84 U$2.GND | 102.53,36.22 C8.1 101.85,36.32 C6.2 99.46,35.73 U1.25 U1.26 100.11,33.16 99.72,32.77 97.19,32.77 96.86,33.1 U1.21 96.86,35.64 96.23,36.27 95.55,36.27 95.55,36.53 95.6,36.58 | 90.88,16.58 91.33,17.03 WLAN1.GND | 95.58,8.98 v95.6,8.96 | v95.6,3.67 95.7,3.56 | WLAN1.GPIO15 95.7,3.56 | 95.92,2.7 95.7,2.91 95.7,3.56 | U1.7 97.51,28 96.55,28.96 91.15,28.96 | v90.2,31.19 91.15,31.19 | U1.18 94.91,35.31 C7.2 95.6,35.95 95.6,36.58 | 91.15,35.95 92.42,37.22 94.96,37.22 95.6,36.58 | R6.1
  Bottom 0.457: IC5.7 27.32,23.77 26.68,23.13 IC5.1 26.54,21.98 24.8,21.98 | SENSOR1.GND 21.14,9.52 | SENSOR1.GND 21.19,9.64 21.19,12.06 SENSOR2.GND | 21.19,9.58 21.13,9.58 | 21.13,9.58 SENSOR1.GND | 0.97,7.64 0.8,7.46 | 21.12,9.57 SENSOR1.GND | 22.39,2.7 21.75,2.7 21.62,2.83 T3.E | 60.49,2.7 60.48,2.7 | S1.P$2 72.23,2.7 | 95.7,2.73 95.73,2.7 | 75.41,58.27 75.09,58.26 | 61.09,57.97 60.8,58.26 | 73.3,58.14 73.19,58.26 | 69.06,58.26 69.13,58.19 68.93,57.98 R33.2 | 58.95,58.22 58.9,58.26 | 50.33,2.57 50.2,2.7 | R14.1 65.12,2.7 | T1.C 67.66,2.7 | R16.2 44.48,2.7 | C13.1 42.58,2.7 | R18.1 37.81,3.02 38.13,2.7 | C16.2 33.05,2.7 | R20.1 25.75,2.7 | R19.2 35.27,8.65 36.23,7.69 36.23,2.61 36.45,2.61 36.54,2.7 | 21.13,9.58 21.13,9.42 20.03,8.33 20.03,2.7 | 0.8,17.62 8.69,17.62 13.05,21.98 24.8,21.98 | C17.1 24.8,21.98 | v59.09,5.15 59.09,2.7 59.09,2.61 | T2.E 60.36,3.02 60.67,2.7 | 91.15,24.2 91.15,17.95 WLAN1.GND | 91.15,24.2 91.15,28.96 91.15,31.19 91.15,35.95 | 102.53,36.22 104.17,37.85 v106.71,37.85 | v68.61,24.2 68.61,23.56 67.25,22.2 IC2.22 64.07,22.2 63.21,21.34 63.21,20.07 62.9,19.76 59.72,19.76 59.09,20.39 59.09,21.02 59.04,21.07 C4.1 C2.1 58.74,22.88 Q1.2 | IC2.53 80.1,27 79.09,28.01 76.23,28.01 75.28,27.06 75.28,26.74 | 75.28,26.74 75.28,25.15 v76.23,24.2 76.23,21.02 77.5,19.76 80.04,19.76 80.8,19 IC2.63 83.34,19 85.75,16.58 90.88,16.58 | SV2.6 95.58,8.98 | v95.6,14.04 94.33,14.04 91.33,17.03 | R6.1 88.61,57.85 88.61,57.86 JP4.1 86.39,56.9 84.22,56.9 C10.1 | IC4.3 90.84,56.9 90.2,57.54 89.56,57.54 R6.1 | C10.1 84.22,56.95 84.17,56.9 | R26.1 82.26,58.26 | 89.7,58.26 84.26,58.26 84.17,58.17 C10.1 | v93.06,24.2 91.15,24.2
  Bottom 0.457: U3.2 U3.1 54.52,39.05 C9.1 | U3.2 U3.3 U3.4 | U3.2 56.23,37.22 | 56.23,37.22 U3.7 56.23,31.5 56.86,30.87 62.9,30.87 63.21,31.19 66.7,31.19 68.61,29.28 68.61,28.33 68.93,28.01 74.01,28.01 75.28,26.74 | U4.4 65.44,38.17 | 65.44,38.17 65.44,37.85 64.8,37.22 56.23,37.22 | U$5.P$4 v49.56,52.46 | U$5.P$2 v49.56,55 | 49.56,58.26 v49.56,57.54 | v79.41,57.22 79.41,58.26 | T7.E 73.06,38.81 72.42,38.17 65.44,38.17 | R29.2 79.72,47.34 v79.41,47.66
  Bottom 0.813: 108.43,9.05 108.43,2.7 105.76,2.7 95.92,2.7 95.73,2.7 72.23,2.7 67.66,2.7 65.12,2.7 60.67,2.7 60.48,2.7 59.09,2.7 50.2,2.7 44.48,2.7 42.58,2.7 38.13,2.7 36.54,2.7 33.05,2.7 25.75,2.7 22.39,2.7 20.03,2.7 0.8,2.7 0.8,7.46 0.8,17.62 0.8,58.26 49.56,58.26 58.9,58.26 60.8,58.26 69.06,58.26 73.19,58.26 75.09,58.26 79.41,58.26 82.26,58.26 89.7,58.26 | 108.43,14.13 108.43,24.52 | 108.3,24.2 v106.71,24.2 106.08,24.2 104.49,25.79 104.49,28.84
  pour Bottom (isolate 0.61): 0.16,61.12 0.16,0.16 108.75,0.16 108.75,61.12
  pour Top (isolate 0.813): 0.16,7.46 44.93,7.46 44.93,24.61 0.16,24.61 0.16,60.8 108.75,60.8 108.75,0.48 0.16,0.48
MCU_HV_ADC  (via drill 0.5 pad 0.25)
  Top 0.457: v50.2,19.76 54.32,19.76 56.23,21.66 v77.82,21.66
  Bottom 0.457: 42.66,6.51 C13.2 | 44.56,6.56 R16.1 | R16.1 42.62,6.42 C13.2 | C13.2 41.99,6.47 R38.1 | IC2.61 80.15,20.6 79.09,21.66 v77.82,21.66 | R16.1 44.48,18.17 46.38,20.07 48.93,20.07 49.24,19.76 v50.2,19.76
MCU_INT4  (via drill 0.5 pad 0.25)
  Top 0.457: v49.56,21.02 54.01,21.02 55.91,22.93 v70.83,22.93
  Bottom 0.457: T5.C 29.39,10.55 R19.1 30.51,16.9 33.37,19.76 44.8,19.76 46.07,21.02 v49.56,21.02 | IC2.6 75.69,17.44 75.28,17.85 73.37,17.85 72.1,19.12 72.1,21.66 v70.83,22.93
MCU_PWM_INVERTER
  Bottom 0.457: 65.25,10.64 64.93,10.32 R1.2 | R1.2 64.93,10.64 | 65.03,10.64 R1.2 | IC2.15 68.49,12.02 67.02,10.55 65.22,10.55 R1.2
MCU_RESET  (via drill 0.5 pad 0.25)
  Top 0.457: v69.25,18.8 69.25,12.45 v69.88,11.82 | v100.36,20.71 v100.36,11.5
  Bottom 0.406: C12.2 100.72,22.44 R13.1 100.45,20.8 v100.36,20.71
  Bottom 0.457: 72.21,10 S1.P$1 | v69.88,11.82 71.6,10 72.23,10 S1.P$1 | IC2.20 68.4,20.6 69.25,19.76 v69.25,18.8 | v100.36,11.5 99.09,10.23 86.39,10.23 85.14,8.98 SV2.5 85.06,8.96 83.85,8.96 82.9,9.91 R2.1 76.8,9.98 S1.P$1
MCU_RX0
  Bottom 0.406: U1.1 101.79,26.89 103.53,25.15 103.53,21.34 102.58,20.39 101.63,20.39 100.71,19.44 100.71,14.04
  Bottom 0.457: IC2.2 78.89,15.19 81.31,12.77 85.75,12.77 87.03,11.5 87.59,11.5 SV2.4 98.2,11.52 100.71,14.04
MCU_RX1  (via drill 0.5 pad 0.25)
  Top 0.457: v74.33,22.93 v92.11,22.93
  Bottom 0.406: 95.73,17.43 WLAN1.UTXD 95.92,17.62
  Bottom 0.457: v92.11,22.93 94.64,22.93 95.92,21.66 95.92,17.62 | IC2.27 71.06,26.2 v74.33,22.93
MCU_SCL  (via drill 0.5 pad 0.25)
  Top 0.457: v53.05,23.56 v53.05,29.6 57.81,29.6 59.72,31.5 v59.72,35.95
  Bottom 0.457: 31.28,22.07 26.83,17.62 24.21,17.62 SENSOR2.SCL 21.12,14.53 SENSOR1.SCL | 31.23,22.07 28.65,22.07 IC5.4 | 31.28,22.07 31.23,22.07 | 31.23,22.07 31.14,21.98 | 31.28,22.07 31.28,22.11 33.05,23.88 49.24,23.88 49.88,23.25 51.47,23.25 51.78,23.56 v53.05,23.56 54.64,23.56 55.59,24.52 55.59,25.79 56.86,27.06 62.9,27.06 63.53,26.42 63.53,25.47 64.4,24.6 IC2.25 | v53.05,29.6 R22.1 | U4.6 64.17,35.31 63.53,35.95 v59.72,35.95 58.13,35.95 57.5,35.31 U3.6
MCU_SDA  (via drill 0.5 pad 0.25)
  Top 0.457: v50.83,24.52 51.15,24.84 v51.15,29.6 53.69,32.14 v58.13,32.14
  Bottom 0.457: SENSOR1.SDA 7.01,9.59 13.68,9.59 24.09,20 SENSOR2.SDA 24.29,19.84 26.83,19.84 27.97,20.98 IC5.3 27.97,22.48 28.61,23.13 29.12,23.13 30.83,24.84 50.51,24.84 | v50.83,24.52 50.51,24.84 | 50.51,24.84 54.32,24.84 54.64,25.15 54.64,26.11 56.55,28.01 63.53,28.01 64.48,27.06 64.48,25.79 64.87,25.4 IC2.26 | R23.1 51.15,28.33 v51.15,29.6 | U4.5 65.44,33.09 64.48,32.14 62.58,32.14 62.26,31.82 58.45,31.82 v58.13,32.14 58.77,32.77 U3.5
MCU_TX0
  Bottom 0.406: 98.69,14.97 98.69,23.22 98.81,23.6 U1.5
  Bottom 0.457: 98.69,14.97 96.55,12.77 87.03,12.77 85.75,14.04 85.1,14.04 | IC2.3 78.09,17.17 78.45,17.53 80.36,17.53 83.85,14.04 85.1,14.04 | 85.1,14.04 SV2.1
MCU_TX1  (via drill 0.5 pad 0.25)
  Top 0.457: v74.01,25.47 77.82,25.47 78.77,24.52 91.15,24.52 v92.11,25.47
  Bottom 0.406: 97.63,17.47 WLAN1.URXD 97.82,17.52
  Bottom 0.457: v92.11,25.47 94.96,25.47 97.82,22.61 97.82,17.52 | IC2.28 72.48,27 v74.01,25.47
N$1  (via drill 0.5 pad 0.25)
  Top 0.406: J$1.SIG 104.26,11.59 v104.17,11.5
  Bottom 0.406: 103.7,11.97 v104.17,11.5
  Bottom 0.457: WLAN1.ANT 103.7,11.97
N$2
  Bottom 0.457: LED3.C 100.59,40.27 R4.2
N$3  (via drill 0.5 pad 0.25)
  Top 0.457: v82.58,39.44 80.04,39.44 77.82,37.22 77.82,27.69 v78.77,26.74
  Bottom 0.457: IC2.56 79.96,24.6 78.77,25.79 v78.77,26.74 | R26.2 82.26,54.68 R25.1 82.27,52.77 82.58,52.46 v82.58,39.44
N$4
  Bottom 0.305: U2.4 76.42,48.14 75.28,49.28 75.28,49.92 74.33,50.87 74.01,50.87 73.37,51.51 73.37,52.25 L1.P$2
N$5
  Bottom 0.457: U$5.P$1 52,56.27 R3.1
N$6  (via drill 0.5 pad 0.25)
  Top 0.457: v86.39,17.85 v71.78,17.85 | U$6.P$3 94.47,25.96 93.06,27.38 v90.2,27.38
  Bottom 0.406: 89.88,18.8 89.88,27.06 v90.2,27.38
  Bottom 0.457: v71.78,17.85 71.69,17.76 IC2.11 71.69,14.77 74.96,11.5 85.12,11.5 85.1,11.52 SV2.3 | v86.39,17.85 88.93,17.85 89.88,18.8
N$7
  Bottom 0.457: R5.2 94.36,40.27 94.36,41.44 LED4.C
N$8
  Bottom 0.457: T1.B 65.18,6.66 R14.2 R1.1 65.22,8.64 D1.A
N$9
  Bottom 0.457: IC2.23 61.22,23 Q1.1 61.14,21.44 C1.2
N$10
  Bottom 0.305: U2.3 76.86,48.65 76.55,48.97 76.55,49.92 77.5,50.87 78.77,50.87 79.09,51.19 79.09,52.16 L1.P$1
N$11
  Bottom 0.457: C2.2 57.38,24.68 Q1.3 59.09,24.84 59.09,25.47 59.72,26.11 62.26,26.11 62.58,25.79 62.58,25.15 63.93,23.8 IC2.24
N$12
  Bottom 0.457: X1.P$2 65.5,14.36 65.12,14.36 64.17,15.31 64.17,18.17 65,19 IC2.18
N$13  (via drill 0.5 pad 0.25)
  Top 0.406: R37.1 93.8,32.03 93.06,32.77
  Top 0.457: 93.06,32.77 v80.99,32.77
  Bottom 0.457: v80.99,32.77 82.11,32.77 T4.C
N$14  (via drill 0.5 pad 0.25)
  Top 0.406: U$6.P$6 95.88,28.36 94.01,30.23 89.25,30.23 87.34,28.33 v87.34,26.42
  Top 0.457: v70.83,20.39 v87.34,20.39
  Bottom 0.406: v87.34,20.39 v87.34,26.42
  Bottom 0.457: IC2.12 70.89,17.16 70.52,17.53 70.52,18.17 70.83,18.48 v70.83,20.39
N$15
  Bottom 0.406: U$2.D- 98.98,31.29 98.77,31.5 94.33,31.5 93.61,32.22 U1.16
N$16
  Bottom 0.406: U1.15 92.96,31.92 94.01,30.87 98.45,30.87 98.68,30.64 U$2.D+
N$17  (via drill 0.5 pad 0.25)
  Top 0.457: v62.26,4.2 v69.56,4.2
  Bottom 0.457: 68.79,6.71 T1.E | T1.E 68.74,6.51 69.16,6.51 69.56,6.1 v69.56,4.2 | T2.B v62.26,4.2 | D1.C 68.66,6.62 T1.E
N$18
  Bottom 0.457: 103.98,56.14 103.98,56.04 R8.1 103.86,55.95 101.63,55.95 100.68,56.9 IC4.6
N$19
  Bottom 0.457: R17.2 49.96,16.58 GEIGER1.ANODE
N$20
  Bottom 0.457: T3.B 23.52,4.83 25.11,6.42 R20.2 28.24,6.42 C15.1
N$21
  Bottom 0.457: R9.1 103.85,52.46 103.53,52.46 100.36,55.63 IC4.7
N$22
  Bottom 0.457: R9.2 105.75,50.24 LED6.K
N$23
  Bottom 0.457: U$5.P$3 49.88,53.73 50.83,52.77 50.83,50.23 51.15,49.92 51.15,48.01 50.83,47.7 50.83,32.45 51.47,31.82 54.64,31.82 56.58,29.88 63.5,29.88 63.81,30.2 IC2.32
N$24
  Bottom 0.457: R8.2 106.08,54.37 LED5.K
N$26
  Bottom 0.406: U1.2 100.76,25.7 101,25.47 101.95,25.47 102.27,25.15 102.27,24.37 C12.1
N$27
  Bottom 0.457: IC4.2 92.42,55.95 R6.2
N$28
  Bottom 0.406: U1.3 100.11,24.41 R13.2
N$29  (via drill 0.5 pad 0.25)
  Top 0.457: 94.88,55.83 R11.1 | 94.75,55.74 R11.1 | R11.1 R10.1 R7.1 98.77,55 v99.41,54.36 | R11.1 R12.1 92.69,55.9 91.47,55.9 91.15,55.9 | C11.2 91.15,55.9 | v91.15,58.17 91.15,55.9
  Bottom 0.457: v99.41,54.36 IC4.8 | IC4.4 v91.15,58.17
N$30
  Bottom 0.457: IC2.19 67.3,19.8 67.66,19.44 67.66,18.17 66.07,16.58 65.82,16.58 X1.P$1
N$31
  Top 0.457: BATTERY1.TEMP 86.94,50.79 JP3.1
  Bottom 0.457: 87.03,50.23 JP3.1 88.3,52.14 88.3,53.73 88.93,54.36 IC4.1
N$32  (via drill 0.5 pad 0.25)
  Top 0.457: v64.17,28.96 74.33,28.96 v76.55,26.74
  Bottom 0.457: v76.55,26.74 78.77,24.52 78.77,23.25 80.62,21.4 IC2.60 | U$5.P$5 49.24,51.19 49.88,50.55 49.88,49.92 50.2,49.6 50.2,48.33 49.88,48.01 49.88,31.82 50.83,30.87 54.32,30.87 56.23,28.96 v64.17,28.96
N$33
  Bottom 0.457: IC2.44 76.49,37.28 75.91,37.85 R30.1
N$34
  Bottom 0.305: U2.1 80.36,49.64 | 80.36,49.64 80.71,49.64 R31.2 | R31.2 80.63,49.91 80.36,49.64
N$35
  Top 0.457: C20.1 55.05,13.41 D3.A D2.C 57.06,7.41 C14.1
N$36  (via drill 0.5 pad 0.25)
  Top 0.457: U$6.P$2 94,25.16 92.74,26.42 v88.93,26.42
  Bottom 0.406: IC2.51 86.75,28.6 v88.93,26.42
N$37
  Bottom 0.305: C3.2 70.88,54.68 71.15,54.68 72.42,53.41 72.42,49.92 72.7,49.64 U2.10
N$38  (via drill 0.5 pad 0.25)
  Top 0.457: U$6.P$4 94.94,26.76 93.38,28.33 v88.93,28.33
  Bottom 0.406: IC2.50 87.86,29.4 v88.93,28.33
N$39  (via drill 0.5 pad 0.25)
  Top 0.406: U$6.P$5 95.41,27.56 93.69,29.28 v90.2,29.28
  Bottom 0.406: IC2.49 89.28,30.2 v90.2,29.28
N$40  (via drill 0.5 pad 0.25)
  Top 0.457: U$6.P$15 80.29,35.56 v79.72,35
  Bottom 0.457: IC2.47 78.89,34.16 v79.72,35
N$41  (via drill 0.5 pad 0.25)
  Top 0.457: U$6.P$16 79.18,36.36 v79.09,36.27
  Bottom 0.457: IC2.46 78.09,35.27 v79.09,36.27
N$42  (via drill 0.5 pad 0.25)
  Top 0.457: v34.64,6.74 v37.81,6.74
  Bottom 0.457: C15.2 28.6,4.74 30.1,4.74 R18.2 30.19,5.47 31.46,6.74 32.78,6.74 C16.1 33.32,6.74 v34.64,6.74 | v37.81,6.74 37.81,7.37 38.45,8.01 39.98,8.01 GEIGER1.CATHODE
N$43  (via drill 0.5 pad 0.25)
  Top 0.457: v83.22,26.74 83.22,27.38 v87.03,31.19 | U$6.P$18 93.9,37.96 v92.11,39.76
  Bottom 0.457: IC2.54 82.67,26.2 v83.22,26.74 | v87.03,31.19 89.25,33.41 89.25,36.9 v92.11,39.76
N$44  (via drill 0.5 pad 0.25)
  Top 0.457: v84.48,25.79 84.48,27.06 v88.61,31.19 | U$6.P$17 93.11,37.16 v92.11,38.17
  Bottom 0.457: IC2.55 84.1,25.4 v84.48,25.79 | v88.61,31.19 90.2,32.77 90.2,36.27 v92.11,38.17
N$45
  Bottom 0.457: R24.2 81.41,35.24 T4.B 79.69,33.2 IC2.48
N$46
  Bottom 0.305: C3.1 R27.2
N$47
  Bottom 0.305: U2.9 70.96,49.16 R27.1 R32.2 R34.2
N$49
  Bottom 0.305: R32.1 R33.1
N$50
  Bottom 0.305: R34.1 R35.1
N$51  (via drill 0.5 pad 0.25)
  Top 0.457: C19.1 63.12,9.59 D2.A 61.62,9.59 v62.9,8.33
  Bottom 0.457: v62.9,8.33 61.52,8.33 | 61.52,8.33 61.52,8.05 T2.C | L2.P$2 61.1,9.6 D2.A 61.11,8.73 61.52,8.33
N$52
  Top 0.406: U$8.2 102.69,30.16 102.69,30.55 102.47,30.76 U$6.P$9
  Top 0.457: C22.1 102.69,30.55
N$53
  Top 0.457: C19.2 63.12,13.41 D3.C 61.11,17.02 D4.A
N$54  (via drill 0.5 pad 0.25)
  Top 0.457: D4.C 54.95,17.12 C20.2 54.41,16.81 v53.37,17.85
  Bottom 0.457: v53.37,17.85 53.37,14.68 R15.2 R17.1
N$55
  Bottom 0.457: U4.2 62.9,41.42 X2.P$1
N$56
  Bottom 0.457: U4.1 61.62,40.78 X2.P$2
N$57
  Bottom 0.457: T7.B R30.2
N$59
  Bottom 0.457: T3.C 22.57,7.06 R21.2 T5.B
N$61
  Bottom 0.457: R15.1 R38.2
N$62  (via drill 0.5 pad 2)
  other vias: 1.03,60.03
N$63  (via drill 0.5 pad 2)
  other vias: 1.03,1.03
N$64  (via drill 0.5 pad 2)
  other vias: 108.03,1.03
N$65  (via drill 0.5 pad 0.25)
  Top 0.457: v76.55,42.62 v83.85,42.62
  Bottom 0.457: R36.1 Q2.1 95.75,49.75 88.61,42.62 v83.85,42.62 | U4.3 64.17,40.08 66.7,42.62 v76.55,42.62
N$66  (via drill 0.5 pad 2)
  other vias: 108.03,60.03
N$67  (via drill 0.8 pad 1.42)
  other vias: 37.78,22.53
N$68  (via drill 0.8 pad 1.42)
  other vias: 37.78,9.53
N$69  (1 unrouted)
  Bottom 0.457: C1.1 59.09,21.34 59.09,22.93
N$70  (via drill 0.8 pad 1.42)
  other vias: 3.78,9.53
N$71  (via drill 0.8 pad 1.42)
  other vias: 3.78,22.53
N$75
  Top 0.406: U$6.P$10 95.55,31.56 R37.2
POWER_CONTROL
  Bottom 0.305: U2.8 74.96,48.65 75.91,47.7
  Bottom 0.457: IC2.45 77.29,38.28 R28.1 R29.1 77.82,45.79 75.91,47.7
RXLED
  Bottom 0.406: U1.22 97.51,37.84 96.55,38.8 R5.1
  Bottom 0.457: 96.68,39.85 96.36,40.17 R5.1
SOLDER_TUBE  (via drill 0.5 pad 0.25)
  Top 0.457: v71.47,41.34 v92.11,41.34
  Bottom 0.457: T7.C 71.32,41.2 v71.47,41.34 | v92.11,41.34 92.11,42.3 94.64,44.84 95.92,44.84 SP4.2
TXLED
  Bottom 0.406: U1.23 98.16,37.88 98.77,38.49 R4.1
  Bottom 0.457: R4.1 98.59,40.17
VBAT  (via drill 0.5 pad 0.25)
  Top 0.457: 85.89,43.98 BATTERY1.VCC 86.84,45.29 JP2.1 | v102.27,56.9 v102.27,52.14 | v87.03,53.41 v89.56,53.41 | v74.96,46.42 v83.85,46.42 | v60.99,33.09 v60.99,43.57
  Bottom 0.305: U2.7 74.52,48.14
  Bottom 0.406: 74.52,48.14 74.96,47.7
  Bottom 0.457: S2.2 106.44,46.79 105.76,46.11 103.53,46.11 102.27,47.38 v102.27,52.14 | v87.03,53.41 86.98,53.36 84.44,53.36 R25.2 | JP2.1 87.03,45.79 85.12,47.7 | IC4.5 101,58.17 v102.27,56.9 | v89.56,53.41 95.92,53.41 | 95.92,53.41 101,53.41 v102.27,52.14 | 95.92,53.41 95.83,53.32 95.92,53.23 SP4.1 | C10.2 R25.2 | R25.2 | Q2.2 R36.2 101.63,51.51 v102.27,52.14 | 74.96,47.7 v74.96,46.42 74.96,45.16 73.37,43.57 v60.99,43.57 | v83.85,46.42 85.12,47.7 | 85.12,47.7 84.8,48.01 84.8,52.45 R25.2 | U4.8 61.62,33.73 v60.99,33.09
VCC_3.3V  (via drill 0.5 pad 0.25)
  Top 0.457: v85.44,19.12 v76.55,19.12 | U$8.3 102.69,27.01 C23.1 102.69,23.67 101.63,22.61 v101.63,18.8 | v48.93,22.3 v48.93,26.42 | v52.73,33.09 v49.24,29.6 | v52.1,48.97 v48.93,48.97 | v92.11,14.04 v92.11,7.05
  Bottom 0.305: U2.6 72.46,47.66 72.42,47.7
  Bottom 0.406: 103.67,4.84 WLAN1.VCC | 103.9,5.83 103.62,5.56 | 103.85,5.15 103.53,5.47 103.62,5.56 | 103.67,5.56 103.62,5.56 | v101.63,18.8 101.63,17.48 WLAN1.CH_PD
  Bottom 0.457: SENSOR1.VCC 6.87,19.78 7.04,19.78 13.05,25.79 24.8,25.79 | IC5.2 27.32,22.8 27.96,23.45 IC5.6 | IC5.6 | T5.E R21.1 24.09,10.84 24.09,11.27 | 24.09,11.27 SENSOR2.VCC 24.29,12.62 24.65,12.62 33.05,21.02 44.8,21.02 45.75,21.98 48.61,21.98 v48.93,22.3 55.27,22.3 55.59,21.98 55.59,19.76 56.27,19.07 C4.2 57.45,18.8 63.21,18.8 | 24,11.19 24.09,11.27 | 103.67,4.84 103.67,5.56 102.71,6.51 | WLAN1.CH_PD 101.7,16.09 102.71,15.08 102.71,6.51 | C5.2 103.9,5.83 | 63.21,18.8 64.17,19.76 64.17,21.02 64.54,21.4 IC2.21 67.72,21.4 70.52,24.2 71.15,24.2 73.06,22.3 73.06,19.76 73.69,19.12 v76.55,19.12 76.86,18.8 80.04,18.8 80.59,18.26 81.59,18.26 IC2.64 82.55,18.2 85.12,15.63 86.71,15.63 87.62,14.72 | 63.21,18.8 63.21,16.26 62.26,15.31 61.29,15.31 L2.P$1 | 24.8,25.79 26.7,25.79 | 26.7,25.79 27.97,25.79 | 27.97,25.79 28.61,25.79 | C17.2 24.8,25.79 | IC5.5 28.62,25.77 28.61,25.79 | IC5.6 27.96,25.78 27.97,25.79 | IC5.8 26.67,25.76 26.7,25.79 | IC2.62 84.76,19.8 84.8,19.76 | 84.8,19.76 v85.44,19.12 | SV2.2 87.62,14.72 | 84.8,19.76 85.75,20.71 85.75,27.06 85.01,27.8 IC2.52 80.57,27.8 80.04,28.33 80.04,30.55 80.67,31.19 83.22,31.19 83.53,31.5 83.53,34.04 83.21,34.36 T4.E 83.11,35.24 R24.1 | 28.61,25.79 48.29,25.79 48.61,26.11 v48.93,26.42 v48.93,26.43 R23.2 | R23.2 | R23.2 | R22.2 R23.2 | U3.8 54.52,34.12 | 54.52,34.12 C9.2 | 54.52,34.12 53.13,34.12 52.73,33.73 v52.73,33.09 | v49.24,29.6 48.61,29.6 | 65.44,54.05 65.44,48.65 66.43,47.66 72.42,47.7 | 65.44,54.05 65.02,54.47 R3.2 v52.1,48.97 | 65.44,54.05 66.07,54.68 R35.2 | v48.93,48.97 48.61,49.6 | 87.62,14.72 91.43,14.72 v92.11,14.04 | 102.71,6.51 102.62,6.42 92.74,6.42 v92.11,7.05 84.48,7.05 83.53,8.01 R2.2
  Bottom 0.813: U$5.P$6 48.61,49.6 48.61,29.6 48.61,26.11
(copper drawn outside any net)
  shapes: Bottom area x207

### Text on the board
Bottom: D.1.0.102
tPlace: http://www.uradmonitor.com | D.1.0.102 | uRADMonitor-D | serial number